# EAGLE design FanController (EAGLE 7.4.0)
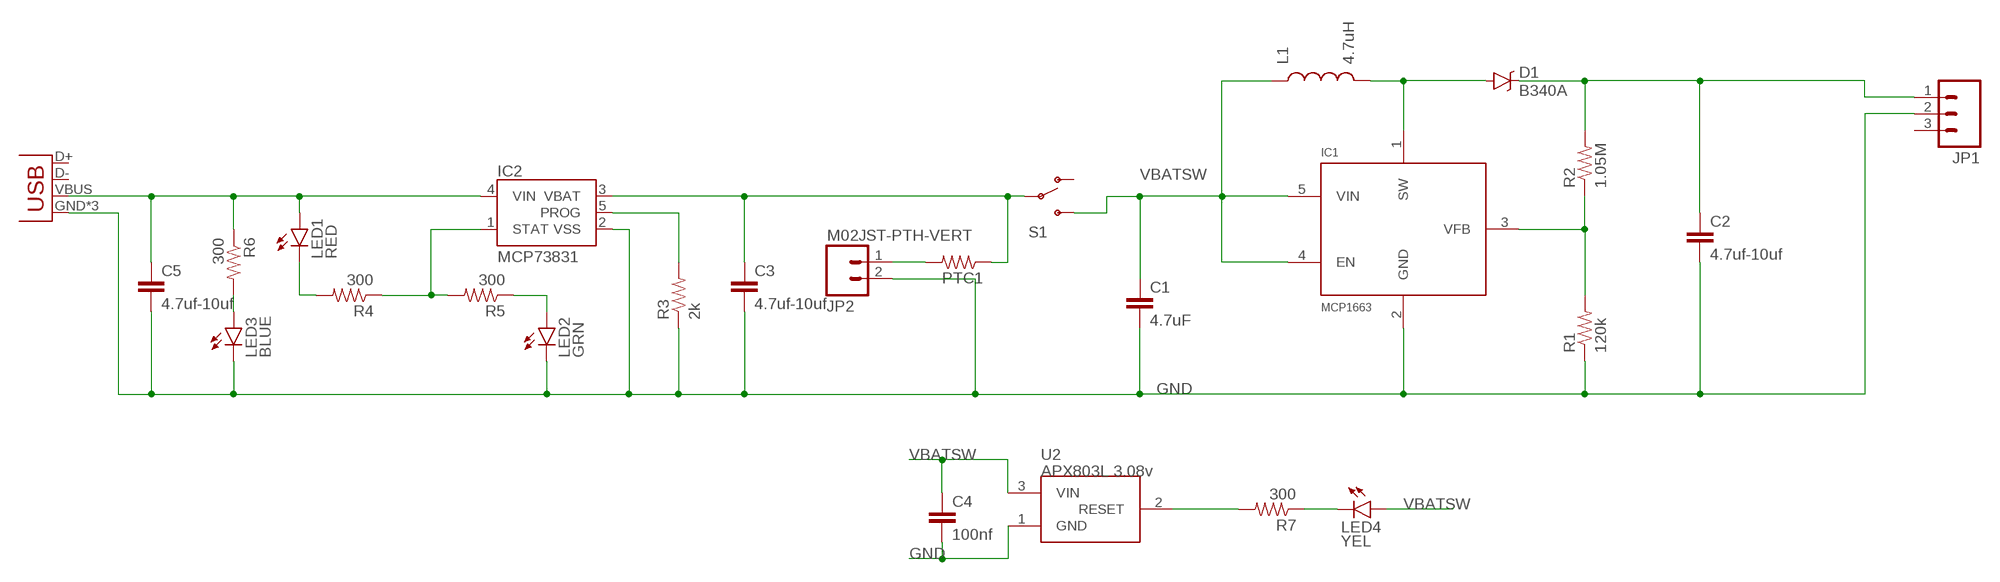
[diagram p0: schematic, sheet 1]

## Parts
C1  4.7uF  CAP1206  [1206]
C2  4.7uf-10uf  CAP1206  [1206]
C3  4.7uf-10uf  CAP1206  [1206]
C4  100nf  CAP1206  [1206]
C5  4.7uf-10uf  CAP1206  [1206]
D1  B340A  DIODE-SCHOTTKY-B340A  [SMA-DIODE]
IC1  MCP1663  [SOT23-5]
IC2  MCP73831  [SOT23-5]
JP1  M03POLAR_LOCK  [MOLEX-1X3_LOCK]
JP2  M02JST-PTH-VERT  [JST-2-PTH-VERT]
JP3  USB-MICROB  [USB-MICROB]
L1  4.7uH  INDUCTOR1210  [1210]
LED1  RED  LED1206  [LED-1206]
LED2  GRN  LED1206  [LED-1206]
LED3  BLUE  LED1206  [LED-1206]
LED4  YEL  LED1206  [LED-1206]
PTC1  RESISTOR1206  [1206]
R1  120k  RESISTOR1206  [1206]
R2  1.05M  RESISTOR1206  [1206]
R3  2k  RESISTOR1206  [1206]
R4  300  RESISTOR1206  [1206]
R5  300  RESISTOR1206  [1206]
R6  300  RESISTOR1206  [1206]
R7  300  RESISTOR1206  [1206]
S1  SWITCH-SPDTKIT  [SWITCH-SPDT_KIT]
U2  APX803L 3.08v  ADP160  [SOT23]

## Nets
GND: C1.2 C2.2 C3.2 C4.2 C5.2 IC1.2(GND) IC2.2(VSS) JP1.2 JP2.2 JP3.GND JP3.MT1(GND) JP3.MT2(GND) LED2.C LED3.C R1.1 R3.1 U2.1(GND)
N$1: D1.A IC1.1(SW) L1.2
N$2: JP2.1 PTC1.2
N$3: LED1.C R4.2
N$4: C2.1 D1.C JP1.1 R2.2
N$5: IC1.3(VFB) R1.2 R2.1
N$6: IC2.1(STAT) R4.1 R5.2
N$7: IC2.5(PROG) R3.2
N$8: C5.1 IC2.4(VIN) JP3.VBUS LED1.A R6.1
N$9: LED2.A R5.1
N$10: R7.2 U2.2(RESET)
N$11: LED3.A R6.2
N$12: LED4.C R7.1
VBATSW: C1.1 C4.1 IC1.4(EN) IC1.5(VIN) L1.1 LED4.A S1.3(S) U2.3(VIN)
VCHARGE: C3.1 IC2.3(VBAT) PTC1.1 S1.2(P)
Unconnected: JP1.3 JP3.D+ JP3.D- S1.1(O)

## Library data of the parts
C1-C5 = SparkFun-Capacitors:CAP: Capacitor Standard 0603 ceramic capacitor, and 0.1" leaded capacitor.
D1 = SparkFun-DiscreteSemi:DIODE-SCHOTTKY: Schottky diodes in SFE's production catalog BAT20J 1A 23V 0.62Vf RB751 120mA 40V 0.37Vf PMEG4005EJ 0.5A 40V 0.42Vf MBRA140 1A 40V 0.5Vf B340A 3A 40V SMA; PROD_ID: DIO-09886
IC1 = MCP1663:MCP1663
IC2 = SparkFun-PowerIC:MCP73831: Miniature single cell, fully integrated Li-Ion, Li-polymer charge management controller http://ww1.microchip.com/downloads/en/DeviceDoc/21984a.pdf IC-09995; PROD_ID: IC-09995
JP1 = SparkFun-Connectors:M03: Header 3 Standard 3-pin 0.1" header. Use with straight break away headers (SKU : PRT-00116), right angle break away headers (PRT-00553), swiss pins (PRT-00743), machine pins (PRT-00117), and female headers (PRT-00115). Molex polarized connector foot print use with SKU : PRT-08232 with associated crimp pins and housings.
JP2 = SparkFun-Connectors:M02: Standard 2-pin 0.1" header. Use with - straight break away headers ( PRT-00116) - right angle break away headers (PRT-00553) - swiss pins (PRT-00743) - machine pins (PRT-00117) - female headers (PRT-00115) Molex polarized connector foot print use with: PRT-08233 with associated crimp pins and housings. 2.54_SCREWTERM for use with PRT-10571. 3.5mm Screw Terminal footprints for PRT-08084 5mm Screw Terminal footprints for use with PRT-08432
JP3 = SparkFun-Connectors:USB: USB Connectors USB-B-PTH is fully proven SKU : PRT-00139/CONN-08278 USB-miniB is fully proven SKU : PRT-00587 USB-A-PCB is untested. USB-A-H is throughly reviewed, but untested. Spark Fun Electronics SKU : PRT-00437 USB-B-SMT is throughly reviewed, but untested. Needs silkscreen touching up. USB-A-S has not been used/tested USB-MB-H has not been used/tested USB-MICROB has been used. CONN-09505; PROD_ID: CONN-09505
L1 = SparkFun-Passives:INDUCTOR: Inductors Basic Inductor/Choke - 0603 and 1206. Footprints are not proven and vary greatly between part numbers. SRN6045- 33uH, 20% 1.4A SDR0403-560KL - 56uH, 10%, 500mA RMS/740mA peak
LED1-LED4 = SparkFun-LED:LED: LEDs Standard schematic elements and footprints for 5mm, 3mm, 1206, and 0603 sized LEDs. 5mm - Spark Fun Electronics SKU : COM-00529 (and others)
PTC1 R1-R7 = SparkFun-Resistors:RESISTOR: Resistor Basic schematic elements and footprints for 0603, 1206, and PTH resistors.
S1 = SparkFun-Electromechanical:SWITCH-SPDT: SPDT Switch Simple slide switch, Spark Fun Electronics SKU : COM-00102 DPDT SMT slide switch, AYZ0202, SWCH-08179; PROD_ID: SWCH-08261
U2 = APX803L:ADP160: RESET GENERATOR SOT23

## Board
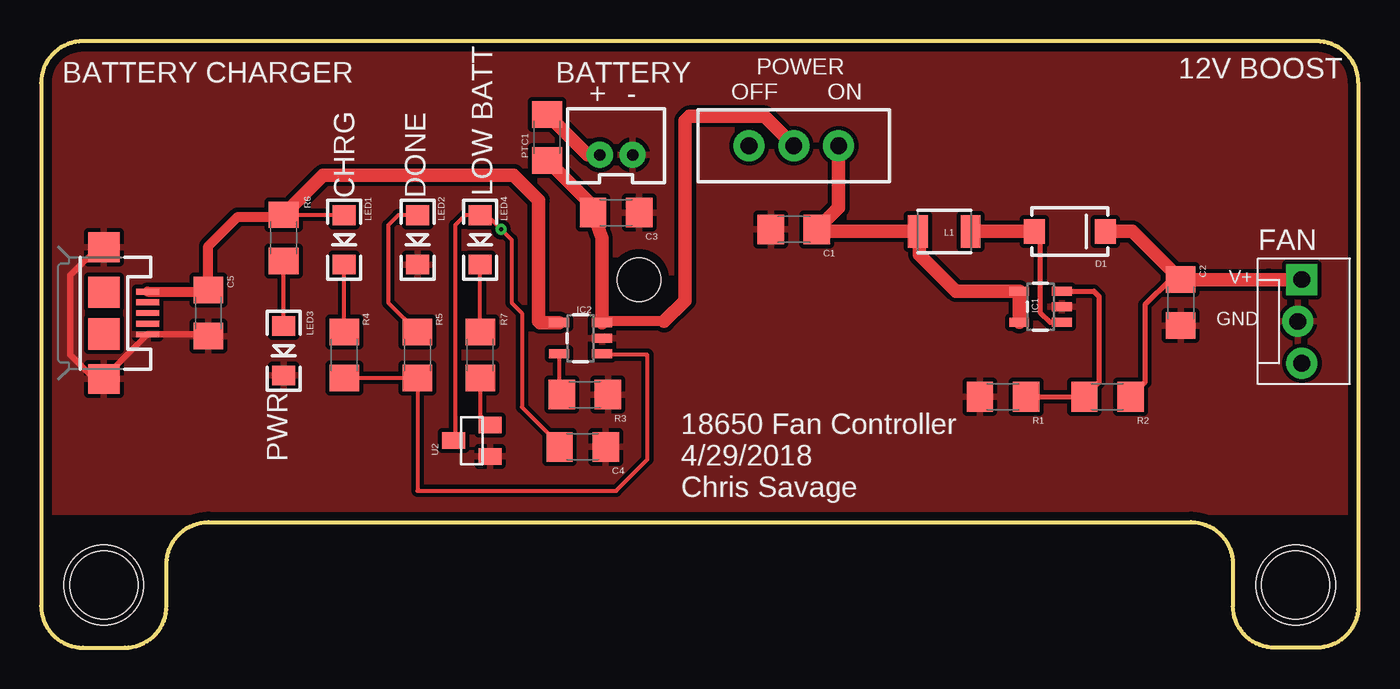
[diagram p1: board, top side]
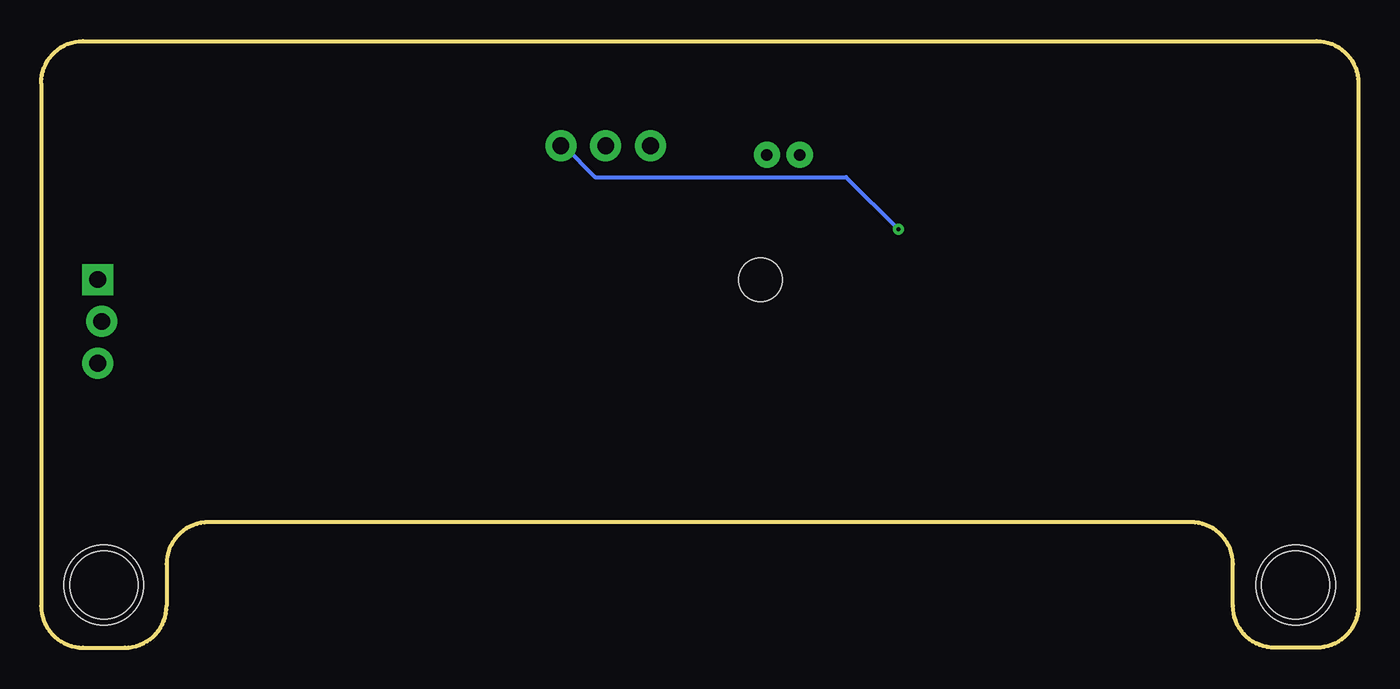
[diagram p2: board, bottom side, seen from below]

Size 80.01 x 36.83 mm. Coordinates in mm from the lower left corner, seen from the top.
Outline: 80.01,34.29 80.01,2.54 arc-90 77.47,0 74.93,0 arc-90 72.39,2.54 72.39,5.08 arc90 69.85,7.62 10.16,7.62 arc90 7.62,5.08 7.62,2.54 arc-90 5.08,0 2.54,0 arc-90 0,2.54 0,34.29 arc-90 2.54,36.83 77.47,36.83 arc-90 80.01,34.29
Copper layers (1*16): Top 0.035mm / dielectric 1.5mm / Bottom 0.035mm
Design rules "default": minimum track width 10mil, minimum drill 10mil, track to track 10mil, track to pad 10mil, pad to pad 10mil, via to via 10mil, smd to smd 8mil, copper to edge 20mil, drill to drill 10mil, minimum pad ring 10mil, minimum via ring 8mil, stop-mask expansion 4mil, vias tented up to drill 0mil, thermal gap 10mil
Holes 4.14 mm at 3.81,3.81 76.2,3.81
Holes 2.64 mm at 36.32,22.35
Holes 4.83 mm at 76.2,3.81 3.81,3.81

### Footprints (pad centres in the part's own frame; a part is rotated, then mirrored left to right if it is on the bottom)
1206 = smd 1.6 x 1.8: 1 -1.4,0; 2 1.4,0
SMA-DIODE = smd 1.27 x 1.47: A -2.15,0; C 2.15,0
SOT23-5 = smd 0.55 x 1.2: 1 -0.95,-1.3; 2 0,-1.3; 3 0.95,-1.3; 4 0.95,1.3; 5 -0.95,1.3
MOLEX-1X3_LOCK = drill 1.016 pad 1.88 square: 1 0,0.127 | drill 1.016 pad 1.88: 2 2.54,-0.127; 3 5.08,0.127
JST-2-PTH-VERT = drill 0.7 pad 1.6: 1 -1,-0.55; 2 1,-0.55
USB-MICROB = smd 0.35 x 1.4: D+ 0,2.65; D- -0.65,2.65; GND 1.3,2.65; ID 0.65,2.65; VBUS -1.3,2.65 | smd 1.8 x 1.9: MT1 -4,0; MT2 4,0 | smd 1.9 x 1.9: P$1 -1.27,0; P$2 1.27,0
1210 = smd 1.2 x 2: 1 -1.6,0; 2 1.6,0
LED-1206 = smd 1.2 x 1.4: A -1.5,0; C 1.5,0
SWITCH-SPDT_KIT = drill 1.016 pad 1.88: 1 0,2.718; 2 0,0; 3 0,-2.718
SOT23 = smd 1 x 1.4: 1 -0.95,-1.1; 2 0.95,-1.1; 3 0,1.1

### Placement (x,y rotation side)
C1  45.72,25.4 180 top
C2  69.22,20.95 270 top
C3  34.92,26.42 0 top
C4  32.89,12.19 0 top
C5  10.16,20.32 270 top
D1  62.48,25.27 0 top
IC1  60.71,20.7 90 top
IC2  32.77,18.8 90 top
JP1  76.45,22.35 270 top
JP2  34.92,30.48 0 top
JP3  3.81,20.32 270 top
L1  54.86,25.27 0 top
LED1  18.41,24.77 270 top
LED2  22.86,24.77 270 top
LED3  14.73,18.03 270 top
LED4  26.67,24.77 270 top
PTC1  30.73,30.99 90 top
R1  58.42,15.24 0 top
R2  64.77,15.24 0 top
R3  33.02,15.37 180 top
R4  18.41,17.78 90 top
R5  22.86,17.78 270 top
R6  14.73,24.89 270 top
R7  26.67,17.78 270 top
S1  45.72,30.48 90 top
U2  26.16,12.57 90 top

### Tracks (layer width: path | path; a pad name or v marks a point on that pad's centre or on a via)
GND
  Top 0.406: C5.2 10.06,19.02 JP3.GND 3.81,16.37 JP3.MT2 3.62,16.51 3.05,16.51 1.78,17.78 1.78,22.61 3.49,24.32 JP3.MT1
  pour Top: 0,37.46 81.92,37.46 81.92,8.25 0,8.25
N$1
  Top 0.305: IC1.1 61.28,19.75 60.71,20.32 60.71,24.9 D1.A
  Top 0.813: L1.2 D1.A
N$2
  Top 0.813: JP2.1 33.19,29.93 PTC1.2
N$3
  Top 0.254: R4.2 LED1.C
N$4
  Top 0.305: C2.1 68.58,22.36 67.06,20.83 67.06,16.13 R2.2
  Top 0.813: D1.C 66.3,25.27 C2.1 74.55,22.36 JP1.1
N$5
  Top 0.305: IC1.3 63.95,21.65 64.26,21.34 64.26,16.13 R2.1 R1.2
N$6
  Top 0.254: R4.1 R5.2 22.86,9.53 34.92,9.53 36.83,11.43 36.83,17.78 34.29,17.78 IC2.1
N$7
  Top 0.254: IC2.5 31.47,15.52 R3.2
N$8
  Top 0.254: R6.1 18.39,26.29 LED1.A
  Top 0.61: JP3.VBUS 10.06,21.62 C5.1 10.16,24.38 11.94,26.16 14.6,26.16 R6.1
  Top 0.813: IC2.4 30.29,19.75 30.23,19.81 30.23,27.18 28.7,28.7 17.14,28.7 R6.1
N$9
  Top 0.254: LED2.A 21.69,26.27 21.08,25.65 21.08,20.96 R5.1
N$10
  Top 0.254: R7.2 26.67,14.11 U2.2
N$11
  Top 0.254: LED3.A R6.2
N$12
  Top 0.254: R7.1 LED4.C
VBATSW  (via drill 0.25)
  Top 0.254: U2.3 25.15,12.66 25.15,25.65 25.76,26.27 LED4.A 26.67,26.67 v27.94,25.4 28.57,24.77 28.57,20.95 29.21,20.32 29.21,14.61 31.11,12.7 C4.1
  Top 0.813: S1.3 48.44,26.72 C1.1 47.25,25.27 L1.1 53.34,25.2 53.34,23.88 55.56,21.65 IC1.4 IC1.5
  Bottom 0.254: v27.94,25.4 31.11,28.58 46.36,28.58 48.26,30.48 S1.3
VCHARGE
  Top 0.61: 37.85,19.81 34.13,19.81 IC2.3
  Top 0.813: IC2.3 34.07,24.86 C3.1 33.53,26.8 PTC1.1 | S1.2 43.94,32.26 39.37,32.26 39.12,32 39.12,21.08 37.85,19.81

### Text on the board
tNames: POWER | BATTERY CHARGER | BATTERY | 12V BOOST | + | - | OFF | ON | CHRG | DONE | LOW BATT | FAN | V+ | GND | PWR | 18650 Fan Controller / 4/29/2018 / Chris Savage